# EAGLE design BMP085_HIH6130 (EAGLE 6.3)
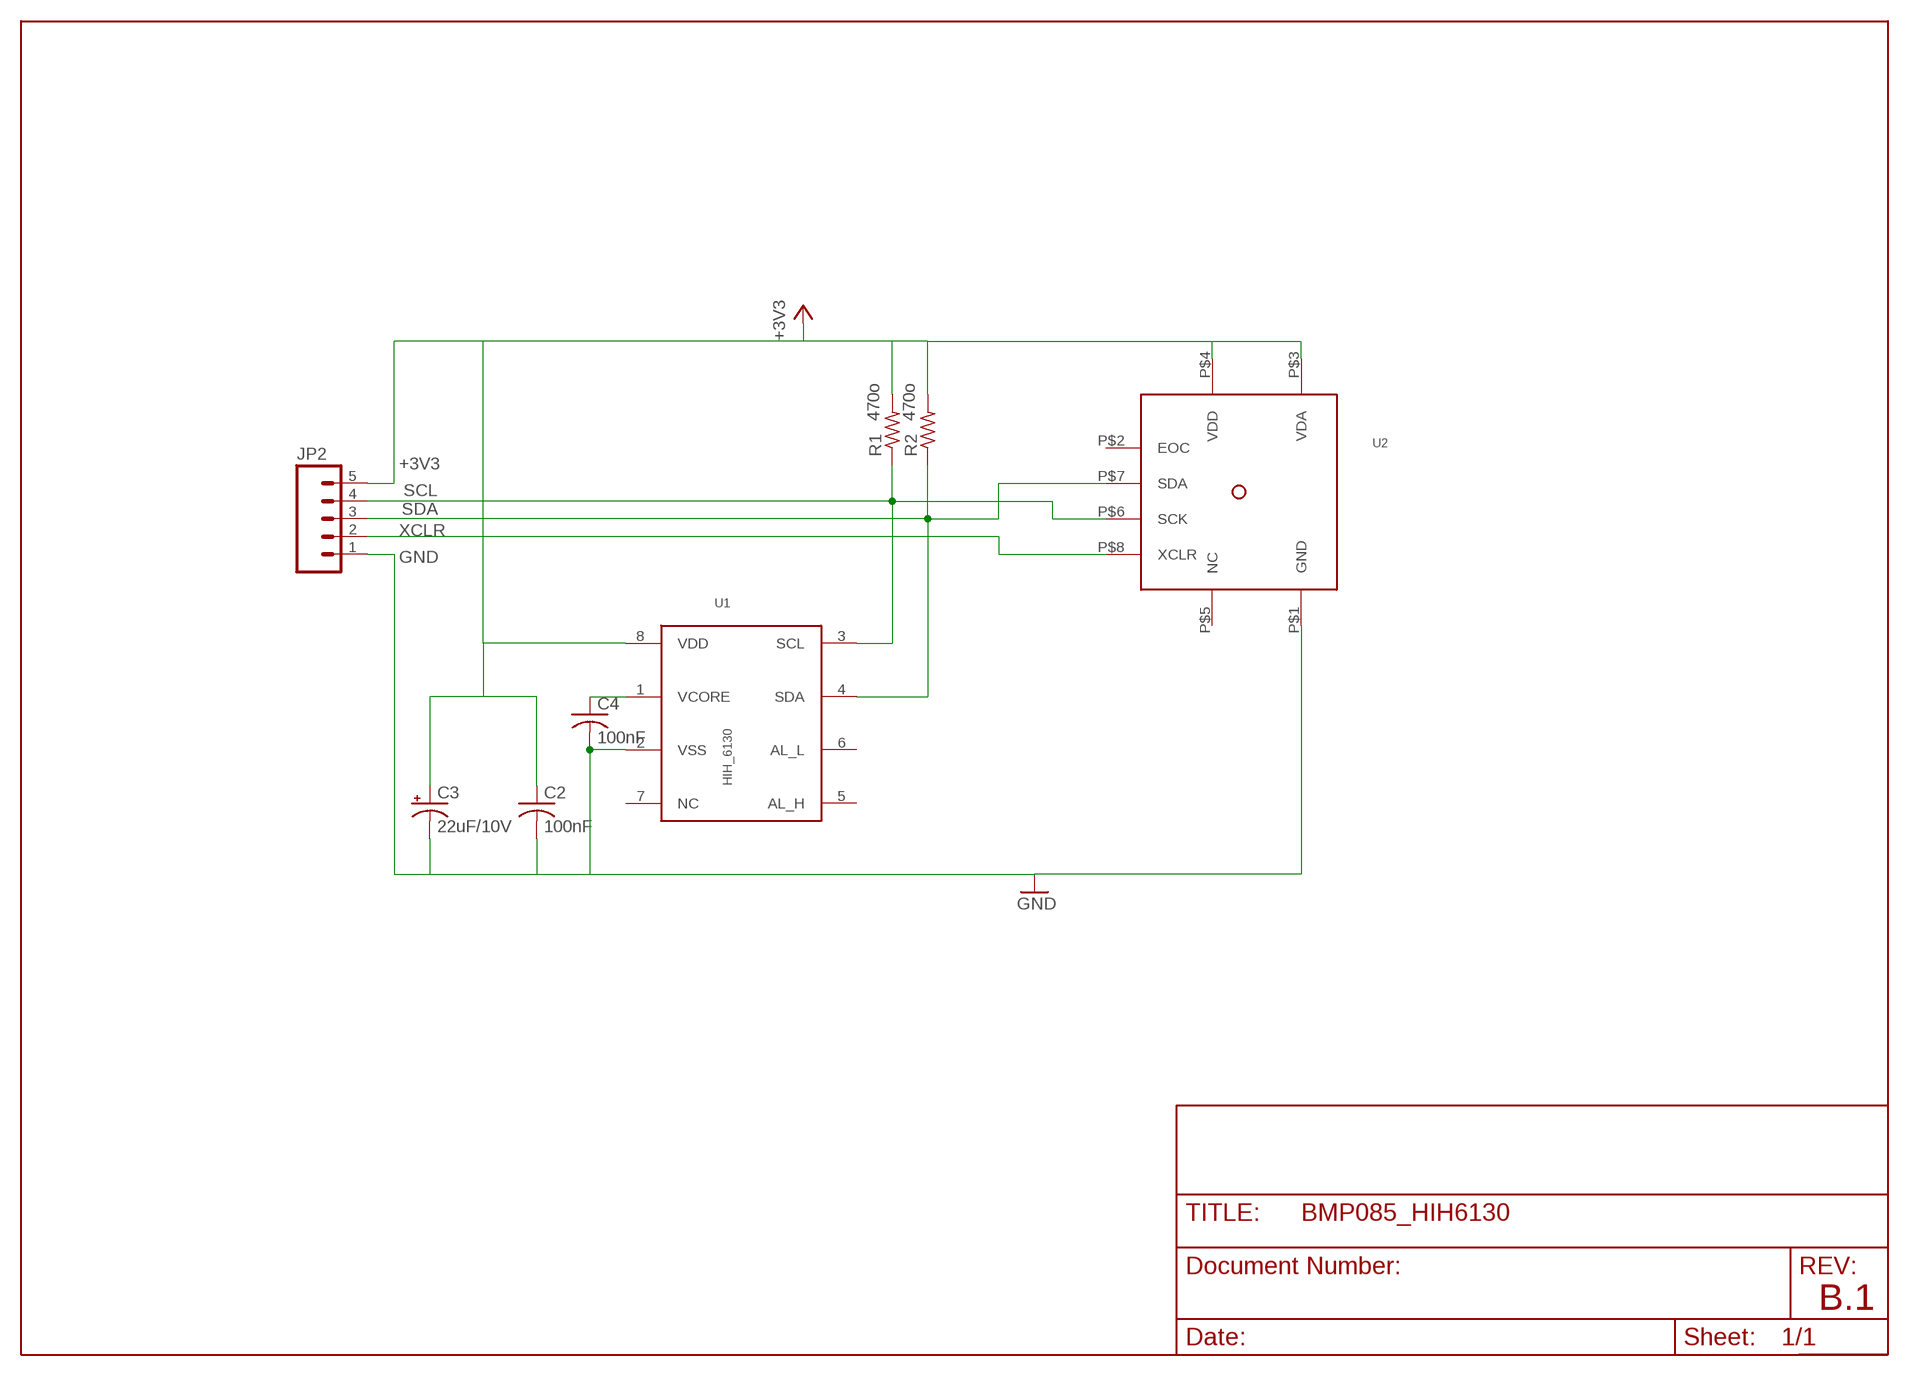
[diagram p0: schematic, sheet 1]

## Parts
C2  100nF  C-USC0805K  [C0805K]
C3  22uF/10V  CPOL-USSMCB  [SMC_B]
C4  100nF  C-USC0805K  [C0805K]
JP2  M05PTH  [1X05]
R1  470o  R-US_R0603  [R0603]
R2  470o  R-US_R0603  [R0603]
U1  HIH_6130  [SOIC8]
U2  BMP085  [LCC8]

## Nets
+3V3: C2.1 C3.+ JP2.5 R1.2 R2.2 U1.8(VDD) U2.P$3(VDA) U2.P$4(VDD)
GND: C2.2 C3.- C4.2 JP2.1 U1.2(VSS) U2.P$1(GND)
N$2: C4.1 U1.1(VCORE)
SCL: JP2.4 R1.1 U1.3(SCL) U2.P$6(SCK)
SDA: JP2.3 R2.1 U1.4(SDA) U2.P$7(SDA)
XCLR: JP2.2 U2.P$8(XCLR)
Unconnected: U1.5(AL_H) U1.6(AL_L) U1.7(NC) U2.P$2(EOC) U2.P$5(NC)

## Notes on the sheet
- B.1

## Library data of the parts
C2 C4 = rcl:C-US: CAPACITOR, American symbol
C3 = rcl:CPOL-US: POLARIZED CAPACITOR, American symbol
JP2 = wifi_WX:M05: Header 5 Standard 5-pin 0.1" header. Use with straight break away headers (SKU : PRT-00116), right angle break away headers (PRT-00553), swiss pins (PRT-00743), machine pins (PRT-00117), and female headers (PRT-00115). Molex polarized connector foot print use with SKU : PRT-08230 with associated crimp pins and housings.
R1 R2 = rcl:R-US_: RESISTOR, American symbol
U1 = Stofer:HIH_6130
U2 = 1AA_Stofer:BMP085

## Board
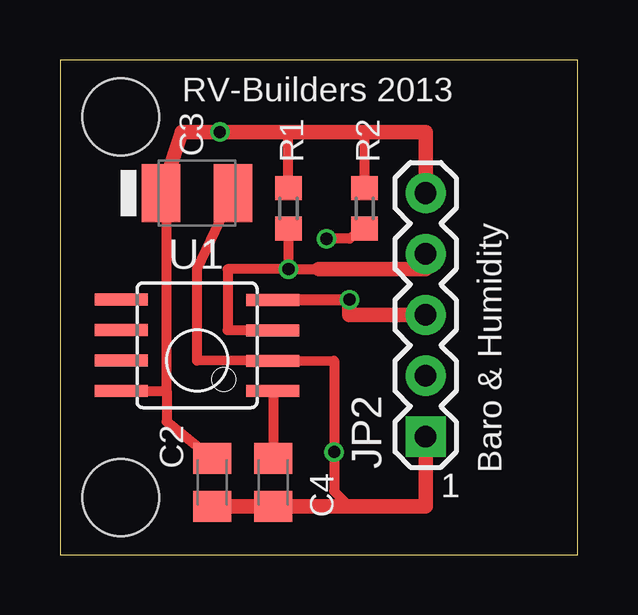
[diagram p1: board, top side]
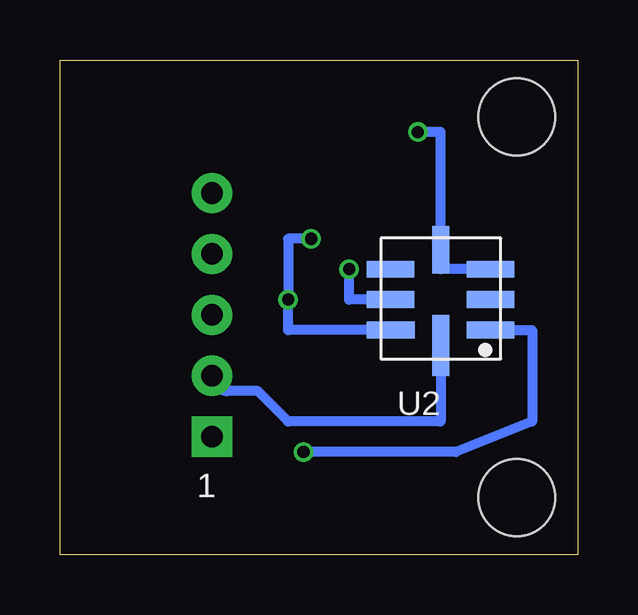
[diagram p2: board, bottom side, seen from below]

Size 21.57 x 20.62 mm. Coordinates in mm from the lower left corner, seen from the top.
Outline: 0,0 21.57,0 21.57,20.62 0,20.62 0,0
Copper layers (1*16): Top 0.035mm / dielectric 1.5mm / Bottom 0.035mm
Design rules "Elecrow_2-layer_with reduced cream mask": minimum track width 6mil, minimum drill 12mil, track to track 6mil, track to pad 6mil, pad to pad 6mil, via to via 6mil, smd to smd 0mil, copper to edge 10mil, drill to drill 10mil, minimum pad ring 10mil, minimum via ring 6mil, stop-mask expansion 2mil, vias tented up to drill 100mil, thermal gap 10mil
Holes 3.2 mm at 2.54,18.25 2.54,2.38

### Footprints (pad centres in the part's own frame; a part is rotated, then mirrored left to right if it is on the bottom)
C0805K = smd 1.3 x 1.6: 1 -1,0; 2 1,0
SMC_B = smd 1.6 x 2.4: + -1.5,0; - 1.5,0
1X05 = drill 0.9 pad 1.676 square: 1 0,0 | drill 0.9 pad 1.676: 2 2.54,0; 3 5.08,0; 4 7.62,0; 5 10.16,0
R0603 = smd 1 x 1.1: 1 -0.85,0; 2 0.85,0
SOIC8 = smd 0.5 x 2.2: 1 -1.905,-3.154; 2 -0.645,-3.154; 3 0.625,-3.154; 4 1.895,-3.154; 5 1.905,3.154; 6 0.635,3.154; 7 -0.635,3.154; 8 -1.905,3.154
LCC8 = smd 1.981 x 0.7: P$1 -0.178,0; P$2 -0.178,-1.27; P$3 -0.178,-2.54; P$5 3.988,-2.54; P$6 3.988,-1.27 | smd 0.7 x 1.981: P$4 1.905,-3.353 | smd 2.007 x 0.7: P$7 3.988,0 | smd 0.7 x 2.55: P$8 1.905,0.635

### Placement (x,y rotation side)
C2  6.34,3.01 270 top
C3  5.71,15.08 0 top
C4  8.89,3.01 270 top
JP2  15.23,4.92 90 top
R1  9.52,14.44 90 top
R2  12.7,14.44 90 top
U1  5.71,8.73 90 top
U2  3.81,9.36 180 bottom

### Tracks (layer width: path | path; a pad name or v marks a point on that pad's centre or on a via)
+3V3  (via drill 0.51)
  Top 0.406: U1.8 4.44,6.82 | 4.44,6.82 4.44,14.44 | 4.44,14.44 4.44,15.71 | R1.2 9.52,17.61 | 4.44,6.82 4.44,5.55 C2.1 | C3.+ 4.44,14.44 | R2.2 12.7,17.61
  Top 0.61: 4.44,15.71 5.08,17.61 v6.66,17.61 9.52,17.61 12.7,17.61 15.23,17.61 JP2.5
  Bottom 0.406: U2.P$3 5.71,11.9 U2.P$4 5.71,17.61 v6.66,17.61
GND  (via drill 0.51)
  Top 0.406: C3.- 5.71,11.9 5.71,8.09 U1.2 11.43,8.09 v11.43,4.28 11.43,2.64 12.06,2.01
  Top 0.61: C2.2 C4.2 12.06,2.01 15.23,2.01 JP2.1
  Bottom 0.406: U2.P$1 1.9,9.36 1.9,5.55 5.08,4.28 v11.43,4.28
N$2
  Top 0.406: U1.1 8.89,6.82 | 9.52,6.82 8.89,6.82 | 8.89,6.82 C4.1
SCL  (via drill 0.51)
  Top 0.406: v9.52,11.9 6.98,11.9 6.98,9.36 U1.3 | R1.1 v9.52,11.9 | v9.52,11.9 10.79,11.9
  Top 0.61: 10.79,11.9 15.23,11.9 JP2.4
  Bottom 0.406: U2.P$6 9.52,10.63 v9.52,11.9
SDA  (via drill 0.51)
  Top 0.406: U1.4 9.52,10.62 | 9.52,10.62 v12.05,10.62 v12.06,10.63 9.52,10.63 9.52,10.62 | R2.1 12.06,13.17 11.32,13.17 v11.11,13.17
  Top 0.61: JP2.3 12.06,10 v12.06,10.63
  Bottom 0.406: v11.11,13.17 12.06,13.17 v12.06,10.63 12.06,9.36 U2.P$7
XCLR
  Bottom 0.406: U2.P$8 5.71,5.55 12.06,5.55 13.33,6.82 14.6,6.82 arc90 JP2.2

### Text on the board
tPlace: Baro & Humidity | 1
bPlace: 1
tNames: RV-Builders 2013
_bsilk: U2